# Altium project Jetson-CAN-Transceiver.PrjPcb
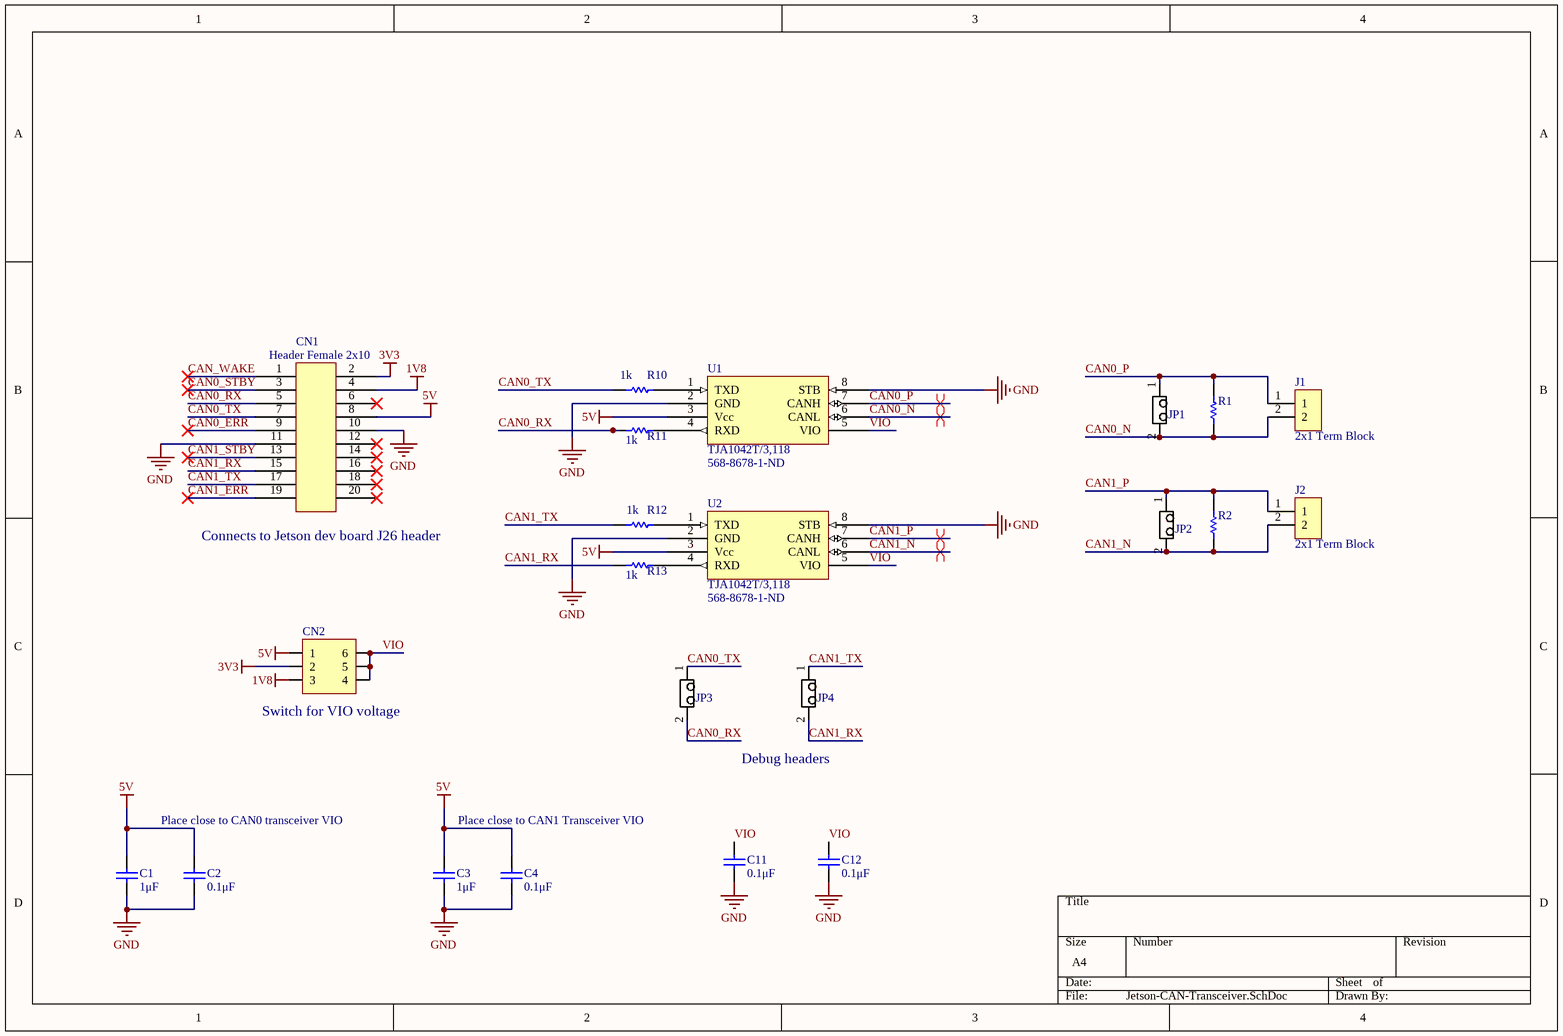
[diagram p0: Jetson-CAN-Transceiver.SchDoc]
1 sheet, 22 parts. Net scope: global (net labels, ports and power ports of the same name join across sheets).
Board file: Jetson-CAN-Transceiver.PcbDoc

## Sheet Jetson-CAN-Transceiver.SchDoc
size A4

### Parts
C1  1μF  [CAPC1608N(0603")]
C2  0.1μF  [CAPC1608N(0603")]
C3  1μF  [CAPC1608N(0603")]
C4  0.1μF  [CAPC1608N(0603")]
C11  0.1μF  [CAPC1608N(0603")]
C12  0.1μF  [CAPC1608N(0603")]
CN1  Header Female 2x10  [HEADER, FEMALE/MALE, 2x10, 100mil]
CN2  Header, Male, 2x3, Pitch: 0.1" (2.54mm), THT  [Header, Male, 2x3, Pitch: 0.1" (2.54mm),THT]  (value not drawn)
J1  2x1 Term Block  [2X1 Terminal Blocks]
J2  2x1 Term Block  [2X1 Terminal Blocks]
JP1  1X2 Pin Head  [2X1 Males Header]  (value not drawn)
JP2  1X2 Pin Head  [2X1 Males Header]  (value not drawn)
JP3  1X2 Pin Head  [2X1 Males Header]  (value not drawn)
JP4  1X2 Pin Head  [2X1 Males Header]  (value not drawn)
R1  CRCW0603120KFKEA  [RESC1609X50X30NL10T20]  (value not drawn)
R2  CRCW0603120KFKEA  [RESC1609X50X30NL10T20]  (value not drawn)
R10  1k  [RESC1608N(0603")]
R11  1k  [RESC1608N(0603")]
R12  1k  [RESC1608N(0603")]
R13  1k  [RESC1608N(0603")]
U1  TJA1042T/3,118  Supplier Part Number 1: 568-8678-1-ND  [8-SOIC]
U2  TJA1042T/3,118  Supplier Part Number 1: 568-8678-1-ND  [8-SOIC]

### Nets
1V8: CN1.4 CN2.3
3V3: CN1.2 CN2.2
5V: C1.2(Cathode) C2.2(Cathode) C3.2(Cathode) C4.2(Cathode) CN1.8 CN2.1 U1.3(Vcc) U2.3(Vcc)
GND: C1.1(Anode) C2.1(Anode) C3.1(Anode) C4.1(Anode) C11.1(Anode) C12.1(Anode) CN1.10 CN1.11 U1.2(GND) U1.8(STB) U2.2(GND) U2.8(STB)
CAN0_ERR: CN1.9
CAN0_N: J1.2 JP1.2 R1.2 U1.6(CANL)
CAN0_P: J1.1 JP1.1 R1.1 U1.7(CANH)
CAN0_RX: CN1.5 JP3.2 R11.1
CAN0_STBY: CN1.3
CAN0_TX: CN1.7 JP3.1 R10.1
CAN1_ERR: CN1.19
CAN1_N: J2.2 JP2.2 R2.2 U2.6(CANL)
CAN1_P: J2.1 JP2.1 R2.1 U2.7(CANH)
CAN1_RX: CN1.15 JP4.2 R13.1
CAN1_STBY: CN1.13
CAN1_TX: CN1.17 JP4.1 R12.1
CAN_WAKE: CN1.1
VIO: C11.2(Cathode) C12.2(Cathode) CN2.4 CN2.5 CN2.6 U1.5(VIO) U2.5(VIO)
NetR10_2: R10.2 U1.1(TXD)
NetR11_2: R11.2 U1.4(RXD)
NetR12_2: R12.2 U2.1(TXD)
NetR13_2: R13.2 U2.4(RXD)

Not connected (* = marked no-connect by the designer): CN1 6* 12* 14* 16* 18* 20*

### Layout directives
differential pair: CAN0_N, CAN0_P, CAN1_N, CAN1_P

### Notes on the sheet
- (near CN1) Connects to Jetson dev board J26 header
- (near CN2) Switch for VIO voltage
- Debug headers
- Place close to CAN0 transceiver VIO
- Place close to CAN1 Transceiver VIO

### Library data of the parts
C1 C3 = 1uF 50V 0603 SMD, Ceramic: Capacitor, Ceramic, 50V, +/- 10%, 0603 SMD, X5R; PackageDescription: Chip Capacitor; Value: 1μF; Created By: Lyden Smith; Date Created: 2017-10-26; Supplier 1: Digi-Key; Supplier Part Number 1: 1276-1860-1-ND
C2 C4 C11 C12 = 0.1uF 16V 0603 SMD, Ceramic: Capacitor, Ceramic, 16V, +/- 10%, 0603 SMD, X7R; Published: 16-04-26; Publisher: AUVic; PackageDescription: Chip Capacitor; Value: 0.1μF; Created By: Andy Bates; Supplier 1: Digi-Key; Supplier Part Number 1: 1276-1005-1-ND
CN1 = Header, Female/Male, 2x10, THT, 100mil: Header, Female with extended Male pins, 2x10, THT, 100mil; Supplier 1: Digi-Key; Created By: Poorna Chander Kalidas; Supplier Part Number 1: SAM1204-10-ND
J1 J2 = 2x1 Terminal Block: Made by: Andy Bates; Supplier 1: Digikey; Supplier Part Number 1: ED2740-ND
JP1-JP4 = 1x2 Male Header: Made By: Andy Bates; Supplier 1: Digikey; Supplier Part Number 1: 952-3073-ND
R1 R2 = CMP-2000-03868-1: Manufacturer: Vishay Dale; Part Number: CRCW0603120KFKEA
R10-R13 = 1kR, 1%, 1/10W , 0603, SMD: Created By: Andy Bates; Publisher: AUVic; Date Created: 2017-05-10; Value: 1k; Supplier 1: Digikey; Supplier Part Number 1: 311-1.00KHRCT-ND
U1 U2 = CAN Transceiver: 1/1 Transceiver Half CANbus 8-SO; Made by: Poorna Chander Kalidas; ComponentLink1Description: Digikey; ComponentLink1URL: https://www.digikey.ca/product-detail/en/texas-instruments/SN65HVD232DR/296-26344-1-ND/2254978; Supplier 1: Digi-Key
CN2 = Header, Male, 2x3, Pitch: 0.1" (2.54mm), THT: Publisher: AUVic; Date Published: 2017-09-13; Last Updated: *; Reviewed By: *; Created By: Andy Bates; Supplier 1: Digi-Key; Supplier Part Number 1: 952-2121-ND